# EAGLE design mlx_dev_board (EAGLE 8.0.1)
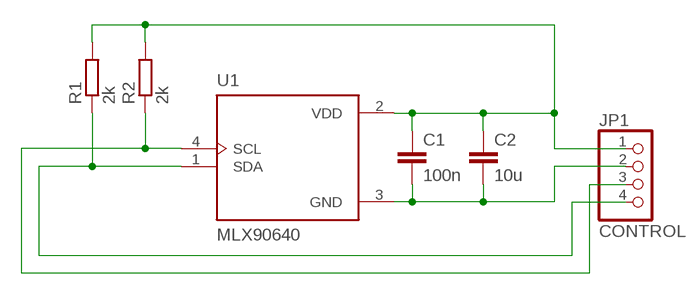
[diagram p0: schematic, sheet 1]

## Parts
C1  100n  C-EUC0805  [C0805]
C2  10u  C-EUC0805  [C0805]
JP1  CONTROL  PINHD-1X4  [1X04]
R1  2k  R-EU_R0805  [R0805]
R2  2k  R-EU_R0805  [R0805]
U1  MLX90640  MLX90640ESF-BAB-000-TU  [TO292P945H1165-4]

## Nets
GND: C1.2 C2.2 JP1.2 U1.3(GND)
SCL: JP1.3 R2.1 U1.4(SCL)
SDA: JP1.4 R1.1 U1.1(SDA)
VDD: C1.1 C2.1 JP1.1 R1.2 R2.2 U1.2(VDD)

## Library data of the parts
C1 C2 = resistor:C-EU: CAPACITOR, European symbol
JP1 = pinhead:PINHD-1X4: PIN HEADER
R1 R2 = resistor:R-EU_: RESISTOR, European symbol
U1 = MLX90640ESF-BAB-000-TU:MLX90640ESF-BAB-000-TU: SENSOR DGTL -40C-85C TO39 Check availability <https://pricing.snapeda.com/parts/MLX90640ESF-BAB-000-TU/Melexis%20Technologies%20NV/view-part?ref=eda>; AVAILABILITY: In Stock; DESCRIPTION: Thermal Image Sensor 32H x 24V - TO-39; MF: Melexis Technologies NV; MP: MLX90640ESF-BAB-000-TU; PACKAGE: TO-39 Melexis Technologies NV; PRICE: None; PURCHASE-URL: https://pricing.snapeda.com/search/part/MLX90640ESF-BAB-000-TU/?ref=eda

## Net classes
0 power: width 1.016 mm, drill 0.9 mm

## Board
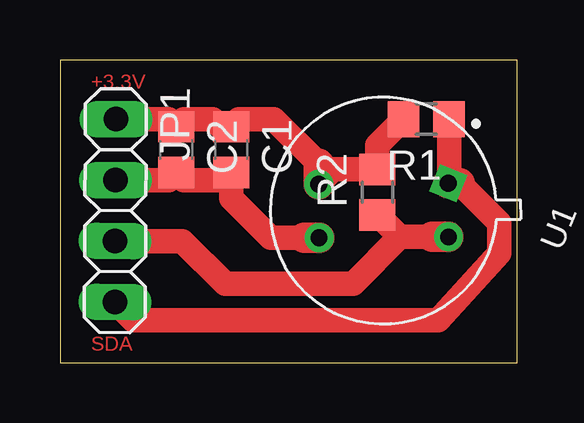
[diagram p1: board, top side]

Size 19.03 x 12.62 mm. Coordinates in mm from the lower left corner, seen from the top.
Outline: 0,0 19.03,0 19.03,12.62 0,12.62 0,0
Copper layers (1*16): Top 0.035mm / dielectric 1.5mm / Bottom 0.035mm
Design rules "default *": minimum track width 10mil, minimum drill 0.9mm, track to track 8mil, track to pad 8mil, pad to pad 8mil, via to via 8mil, smd to smd 8mil, copper to edge 40mil, drill to drill 8mil, minimum pad ring 10mil, minimum via ring 8mil, stop-mask expansion 4mil, vias tented up to drill 0mil, thermal gap 10mil

### Footprints (pad centres in the part's own frame; a part is rotated, then mirrored left to right if it is on the bottom)
C0805 = smd 1.3 x 1.5: 1 -0.95,0; 2 0.95,0
1X04 = drill 1.016 long: 1 -3.81,0; 2 -1.27,0; 3 1.27,0; 4 3.81,0
R0805 = smd 1.3 x 1.5: 1 -0.95,0; 2 0.95,0
TO292P945H1165-4 = drill 0.7 pad 1.1 square: 1 -2.065,2.067 | drill 0.7 pad 1.1: 2 0,-2.92; 3 2.065,-2.065; 4 0,2.92

### Placement (x,y rotation side)
C1  7.11,8.89 270 top
C2  4.83,8.89 270 top
JP1  2.29,6.35 269.7 top
R1  15.24,10.16 180 top
R2  13.21,7.11 90 top
U1  13.46,6.35 247.9 top

### Tracks (layer width: path | path; a pad name or v marks a point on that pad's centre or on a via)
GND
  Top 1.016: JP1.2 4.51,7.62 C2.2 5.15,7.62 6.79,7.62 C1.2 7.11,6.86 8.76,5.21 10.16,5.21 U1.3
  Top 1.27: U1.3 10.16,5.21
SCL
  Top 1.016: 14.14,5.25 15.49,5.25 U1.4 | 14.14,5.25 12.19,3.3 6.86,3.3 5.08,5.08 JP1.3 | JP1.3 | R2.1 13.23,6.16 14.14,5.25
  Top 1.27: U1.4 15.49,5.25
SDA
  Top 1.016: JP1.4 3.03,1.78 15.75,1.78 18.29,4.57 18.29,5.84 16.64,7.49 U1.1 16.19,7.52 R1.1
  Top 1.27: U1.1 16.64,7.49
VDD
  Top 1.016: JP1.1 4.51,10.16 C2.1 5.15,10.16 6.35,10.16 6.67,9.84 C1.1 7.43,10.16 8.89,10.16 10.76,8.29 U1.2 11.37,8.06 R2.2 13.21,9.08 R1.2
  Top 1.27: U1.2 10.76,8.29

### Text on the board
Top: +3.3V | SDA